# EAGLE design sensor_board_001b (EAGLE 8.3.1)
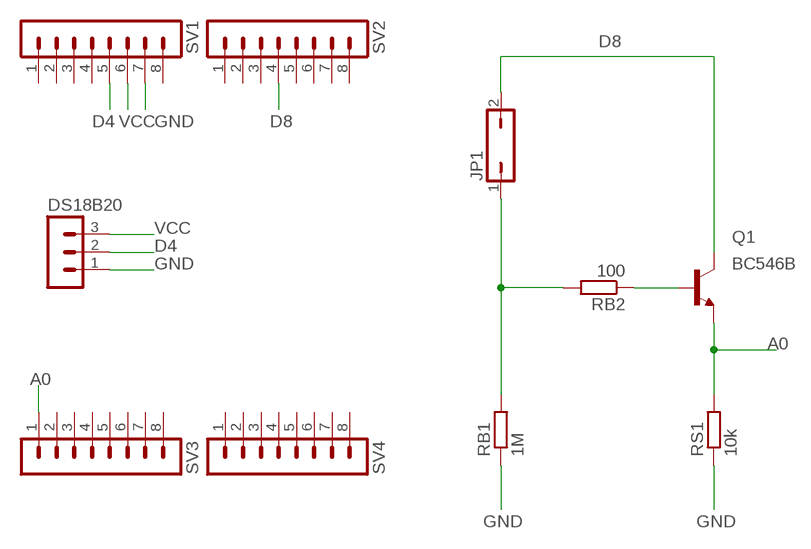
[diagram p0: schematic, sheet 1]

## Parts
DS18B20  MA03-1  [MA03-1]
JP1  JP1Q  [JP1]
Q1  BC546B  [TO92-EBC]
RB1  1M  R-EU_0204/5  [0204/5]
RB2  100  R-EU_0204/2V  [0204V]
RS1  10k  R-EU_0204/7  [0204/7]
SV1  MA08-1  [MA08-1]
SV2  MA08-1  [MA08-1]
SV3  MA08-1  [MA08-1]
SV4  MA08-1  [MA08-1]

## Nets
A0: Q1.E RS1.2 SV3.1
D4: DS18B20.2 SV1.5
D8: JP1.2 Q1.C SV2.4
GND: DS18B20.1 RB1.1 RS1.1 SV1.7
N$2: Q1.B RB2.1
N$3: JP1.1 RB1.2 RB2.2
VCC: DS18B20.3 SV1.6
Unconnected: SV1.1 SV1.2 SV1.3 SV1.4 SV1.8 SV2.1 SV2.2 SV2.3 SV2.5 SV2.6 SV2.7 SV2.8 SV3.2 SV3.3 SV3.4 SV3.5 SV3.6 SV3.7 SV3.8 SV4.1 SV4.2 SV4.3 SV4.4 SV4.5 SV4.6 SV4.7 SV4.8

## Library data of the parts
DS18B20 = con-lstb:MA03-1: PIN HEADER; OC_FARNELL: unknown; OC_NEWARK: unknown
JP1 = jumper:JP1Q: JUMPER
Q1 = transistor-npn:BC546*: NPN Transistor
RB1 RB2 RS1 = resistor:R-EU_: RESISTOR, European symbol
SV1-SV4 = con-lstb:MA08-1: PIN HEADER; OC_FARNELL: unknown; OC_NEWARK: unknown

## Board
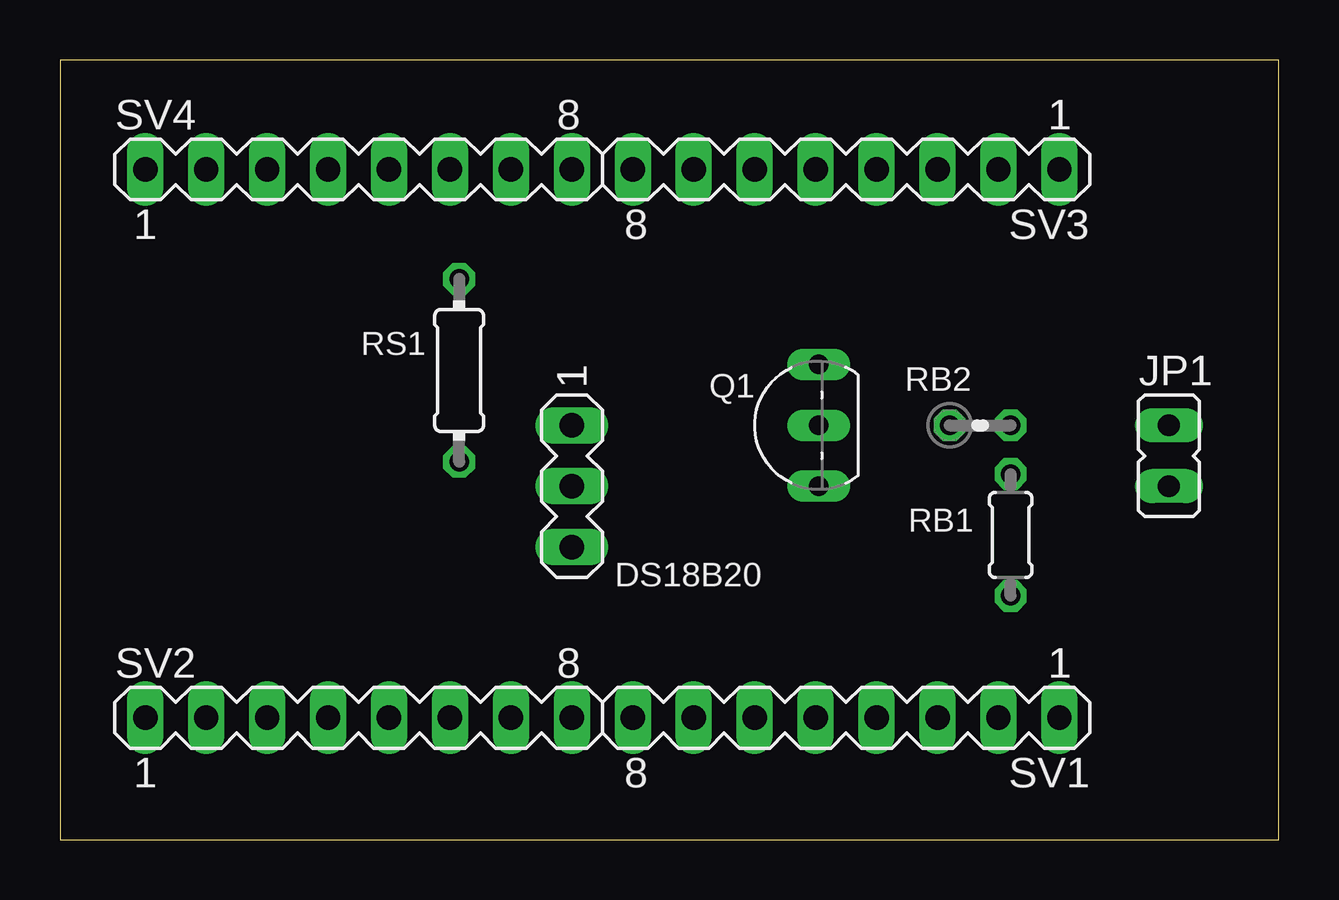
[diagram p1: board, top side]
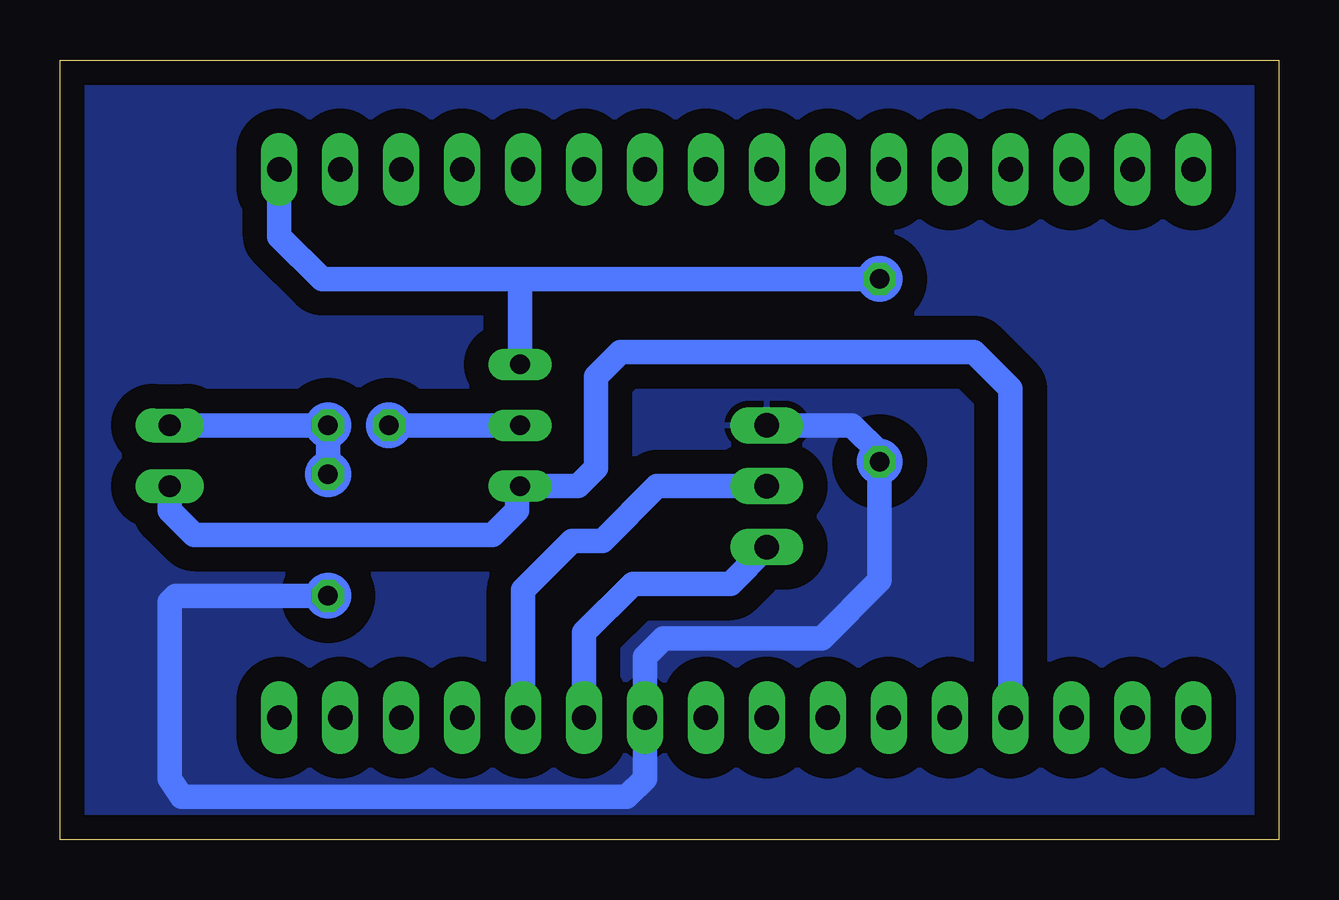
[diagram p2: board, bottom side, seen from below]

Size 50.8 x 32.5 mm. Coordinates in mm from the lower left corner, seen from the top.
Outline: 0,0 50.8,0 50.8,32.5 0,32.5 0,0
Copper layers (1*16): Top 0.035mm / dielectric 1.5mm / Bottom 0.035mm
Design rules "default": minimum track width 6mil, minimum drill 0.35mm, track to track 6mil, track to pad 6mil, pad to pad 6mil, via to via 6mil, smd to smd 6mil, copper to edge 40mil, drill to drill 6mil, minimum pad ring 10mil, minimum via ring 8mil, stop-mask expansion 4mil, vias tented up to drill 0mil, thermal gap 10mil

### Footprints (pad centres in the part's own frame; a part is rotated, then mirrored left to right if it is on the bottom)
MA03-1 = drill 1.016 long: 1 -2.54,0; 2 0,0; 3 2.54,0
JP1 = drill 0.914 long: 1 0,-1.27; 2 0,1.27
TO92-EBC = drill 0.813 long: B 0,-1.27; C -2.54,-1.27; E 2.54,-1.27
0204/5 = drill 0.813 octagon: 1 -2.54,0; 2 2.54,0
0204V = drill 0.813 octagon: 1 -1.27,0; 2 1.27,0
0204/7 = drill 0.813 octagon: 1 -3.81,0; 2 3.81,0
MA08-1 = drill 1.016 long: 1 -8.89,0; 2 -6.35,0; 3 -3.81,0; 4 -1.27,0; 5 1.27,0; 6 3.81,0; 7 6.35,0; 8 8.89,0

### Placement (x,y rotation side)
DS18B20  21.34,14.73 270 top
JP1  46.23,16 180 top
Q1  30.35,17.27 90 top
RB1  39.62,12.7 90 top
RB2  38.35,17.27 0 top
RS1  16.64,19.56 90 top
SV1  32.77,5.08 180 top
SV2  12.45,5.08 0 top
SV3  32.77,27.94 180 top
SV4  12.45,27.94 0 top

### Tracks (layer width: path | path; a pad name or v marks a point on that pad's centre or on a via)
A0
  Bottom 1.016: 31.84,23.37 RS1.2 | 31.84,23.37 39.88,23.37 41.66,25.15 SV3.1 | Q1.E 31.62,23.15 31.84,23.37
D4
  Bottom 1.016: DS18B20.2 25.91,14.73 28.19,12.45 29.46,12.45 31.5,10.41 SV1.5
D8
  Bottom 1.016: JP1.2 46.23,13.72 45.21,12.7 32.77,12.7 31.75,13.72 31.75,14.61 Q1.C 29.21,14.73 28.45,15.49 28.45,19.3 27.43,20.32 12.7,20.32 11.18,18.8 SV2.4
GND
  Bottom 1.016: 21.46,17.4 DS18B20.1 17.78,17.27 16.64,16.13 RS1.1 16.64,10.79 19.05,8.38 25.65,8.38 26.42,7.62 SV1.7 26.42,2.54 27.18,1.78 45.72,1.78 46.23,2.54 46.23,9.91 45.97,10.16 RB1.1
  pour Bottom (isolate 1.016): 0.51,32 0.51,0.51 50.29,0.51 50.29,32
N$2
  Bottom 1.016: Q1.B RB2.1
N$3
  Bottom 1.016: RB1.2 RB2.2 JP1.1
VCC
  Bottom 1.016: SV1.6 28.96,8.64 26.92,10.67 22.86,10.67 DS18B20.3
(copper drawn outside any net)
  shapes: Bottom circle x6